# EasyEDA Pro project ProPrj_CAR BY HAO V1.3(no osd)_2026-07-17.epro, schematic Schematic1

## Sheets
1 mcu f405: Board Name: Board1; Create Date: 2026-05-24; Page Name: mcu f405; Project Name: CAR BY HAO V1.3(no osd); Schematic Name: Schematic1; Update Date: 2026-07-02; Company: EasyEDA.com; Page Size: A4; Version: V1.0
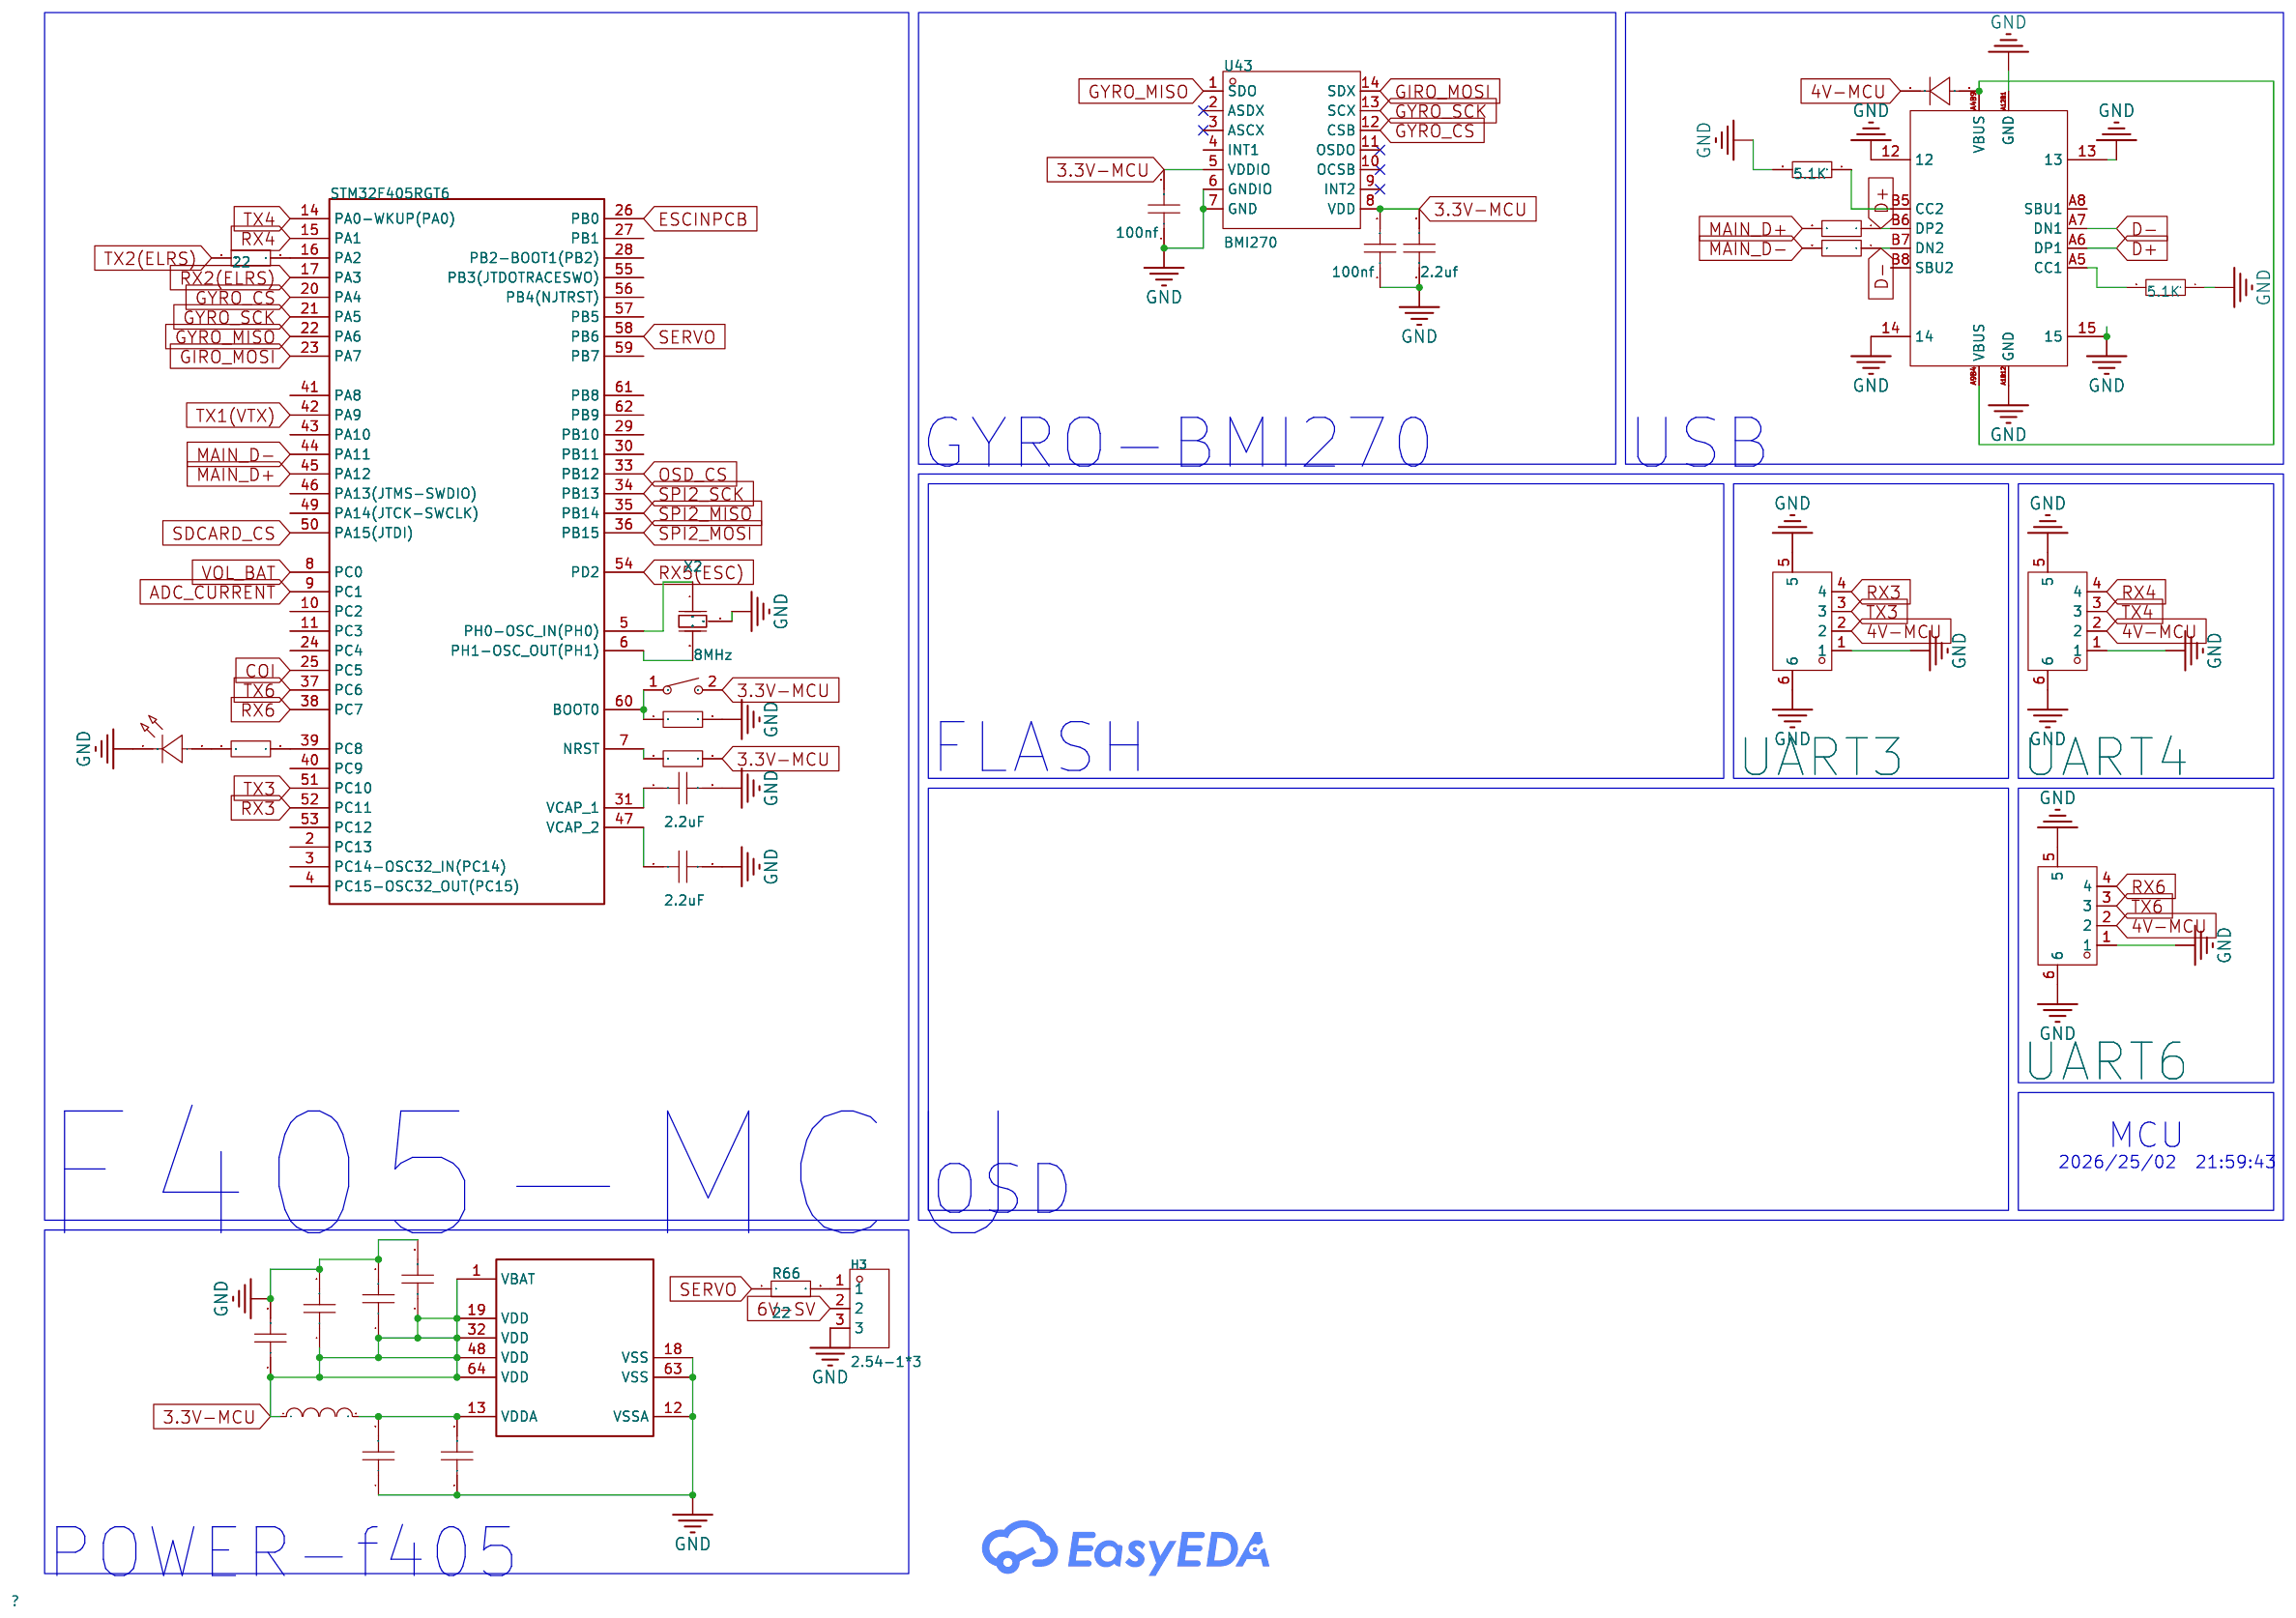
[diagram p0: mcu f405]
2 pô WE rờ: Page Name: pô WE rờ; Update Date: 2026-06-27
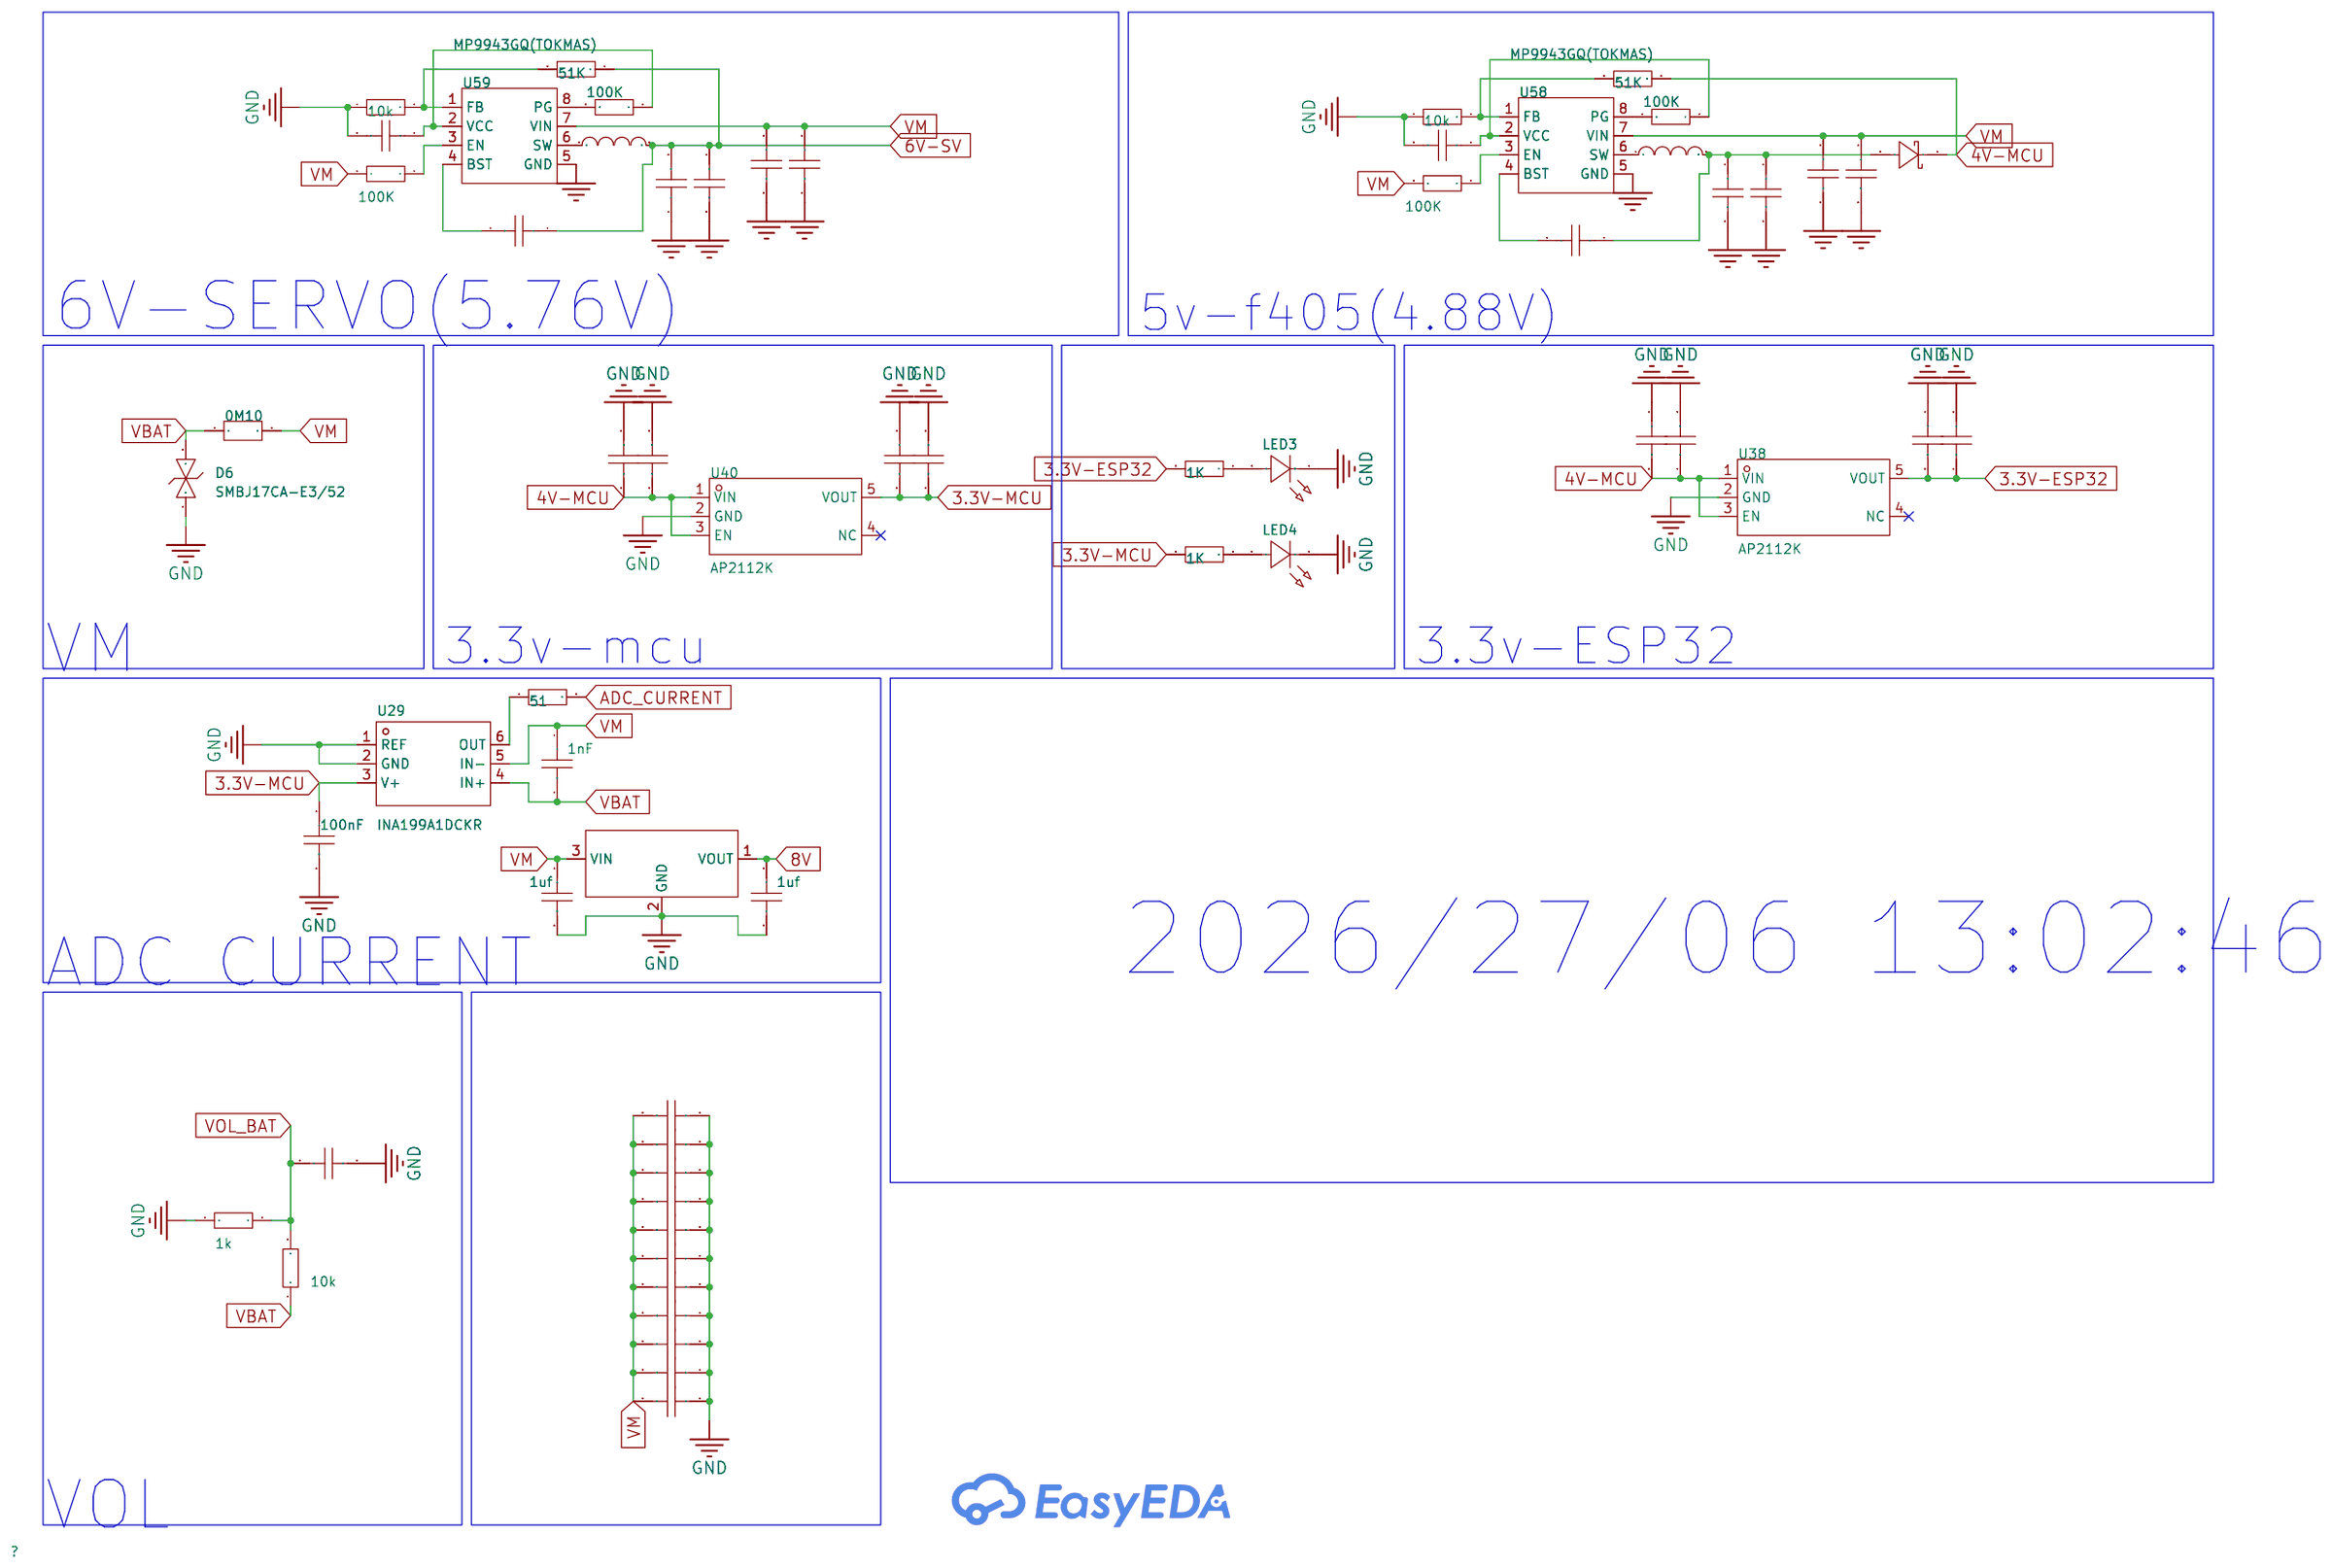
[diagram p1: pô WE rờ]
3 ÉC: Page Name: ÉC; Update Date: 2026-06-27
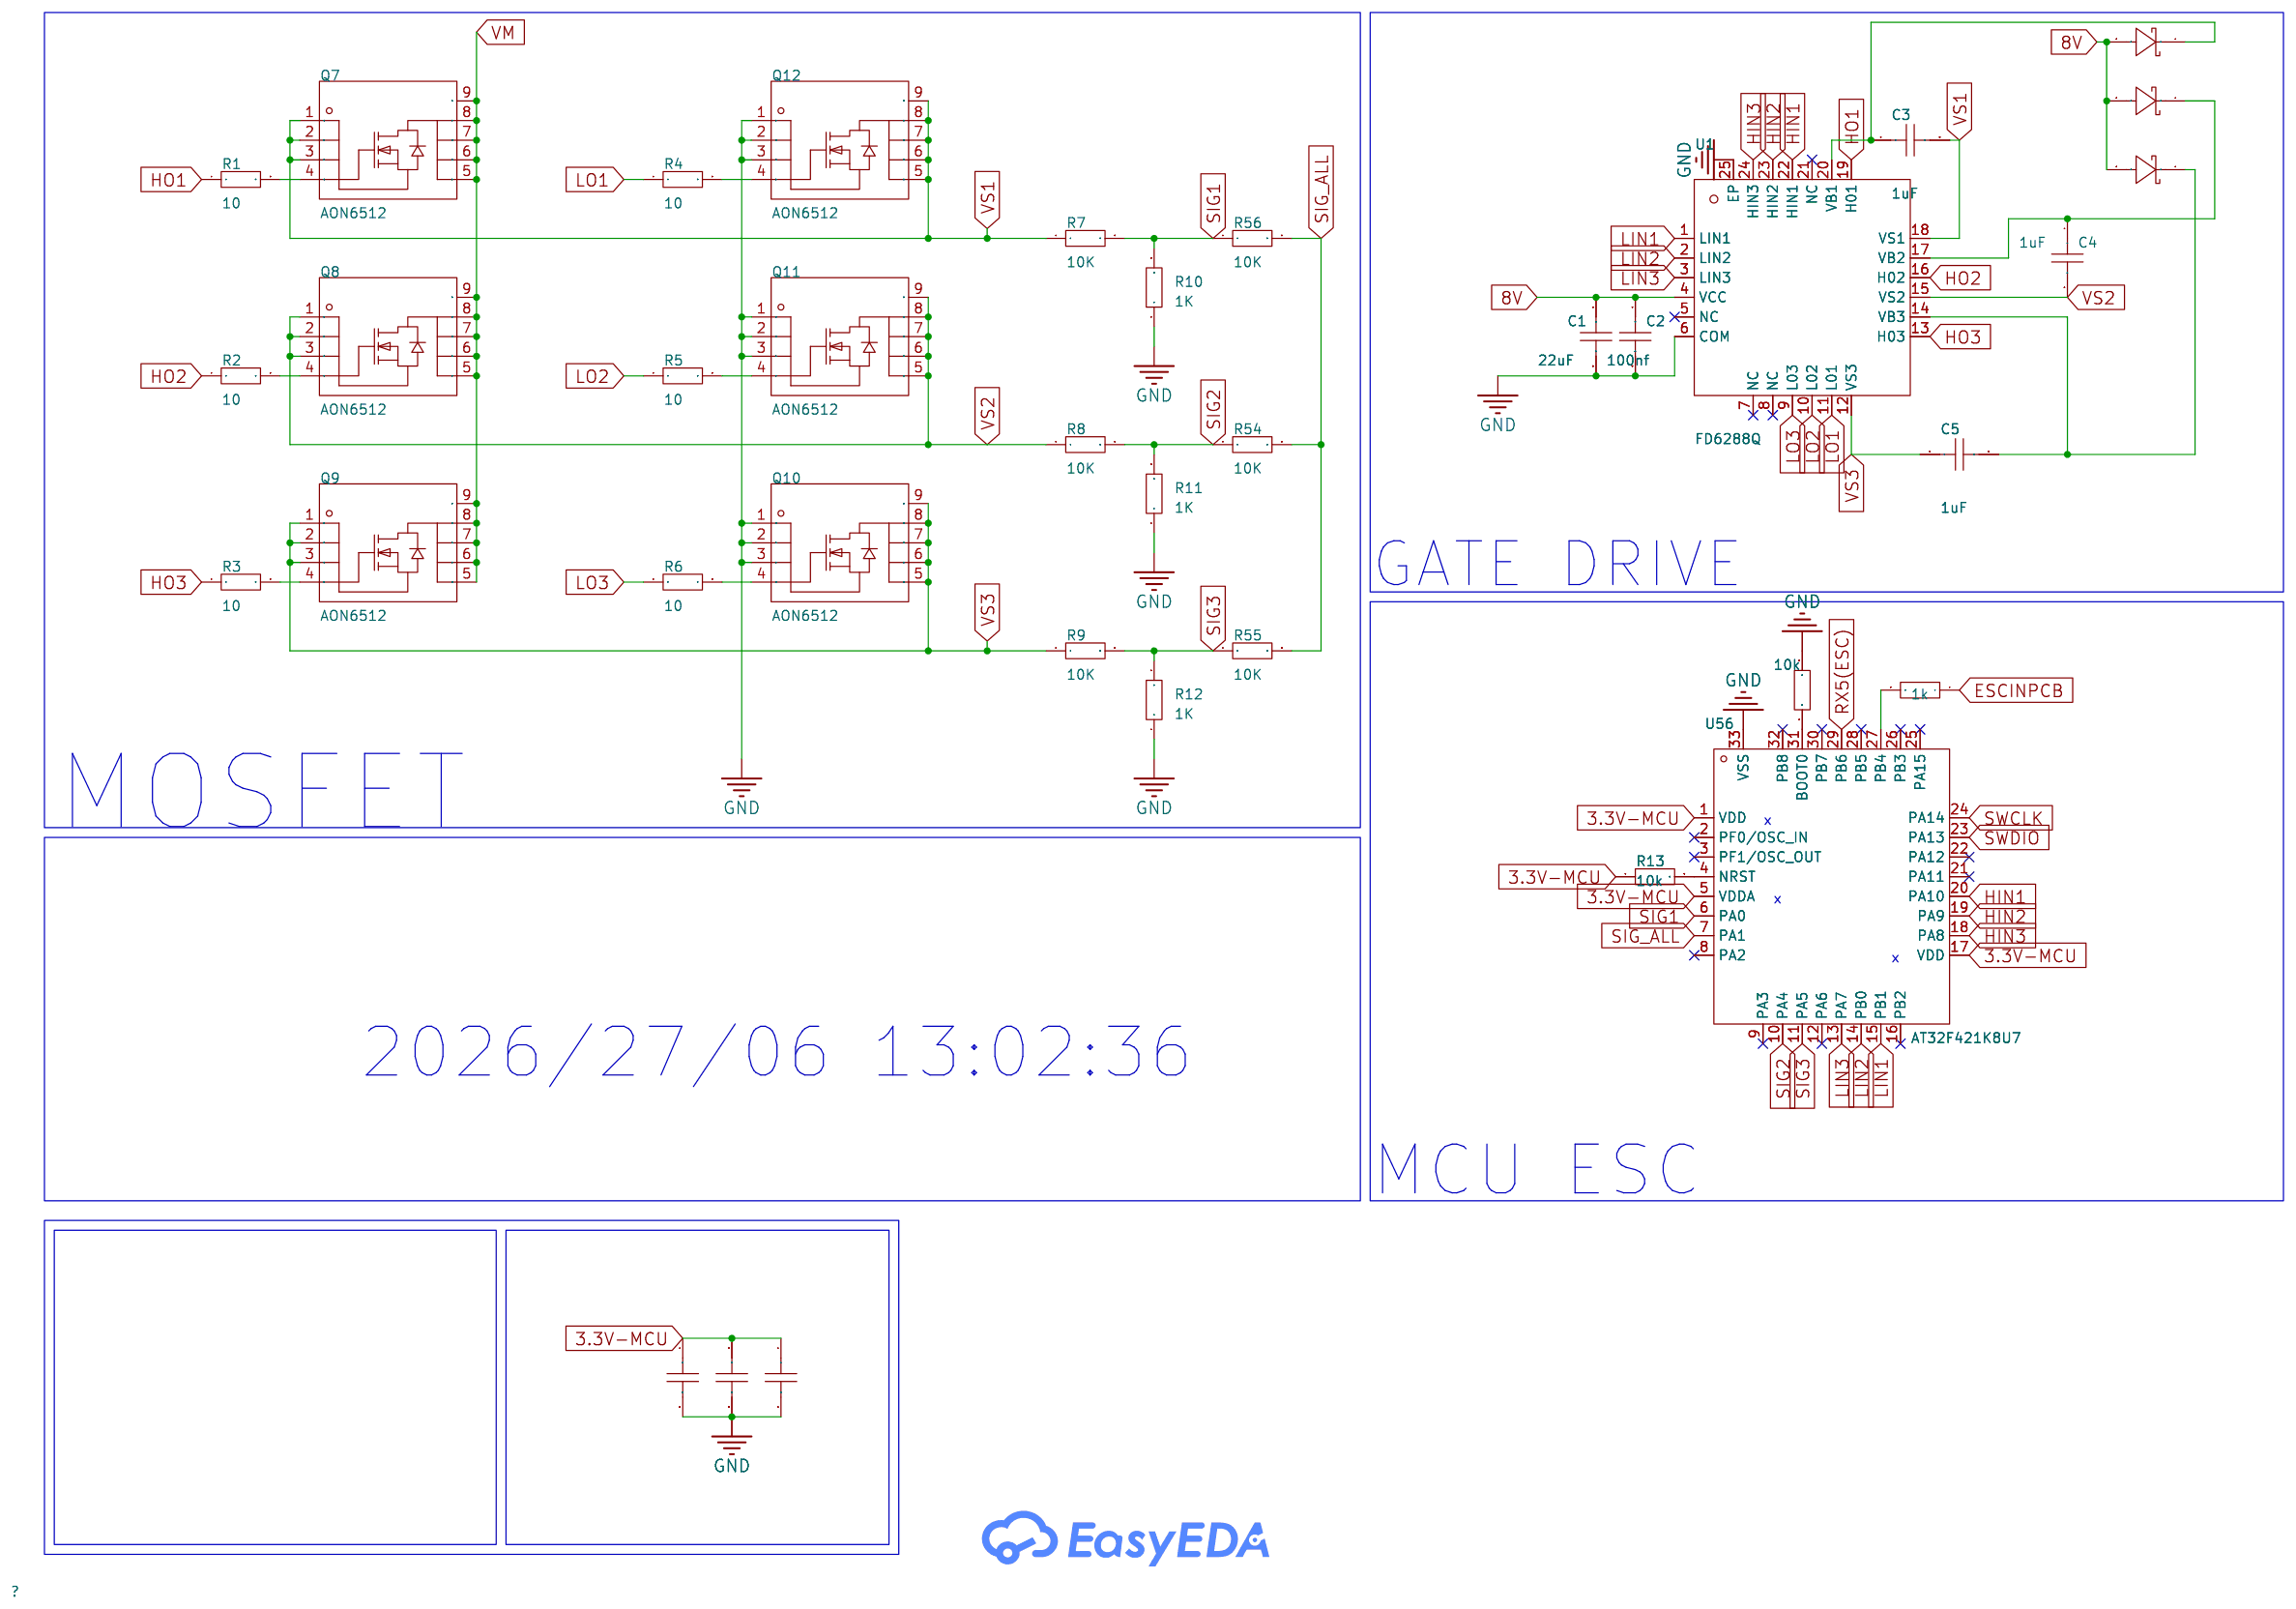
[diagram p2: ÉC]
4 Elrs: Page Name: Elrs; Update Date: 2026-06-27
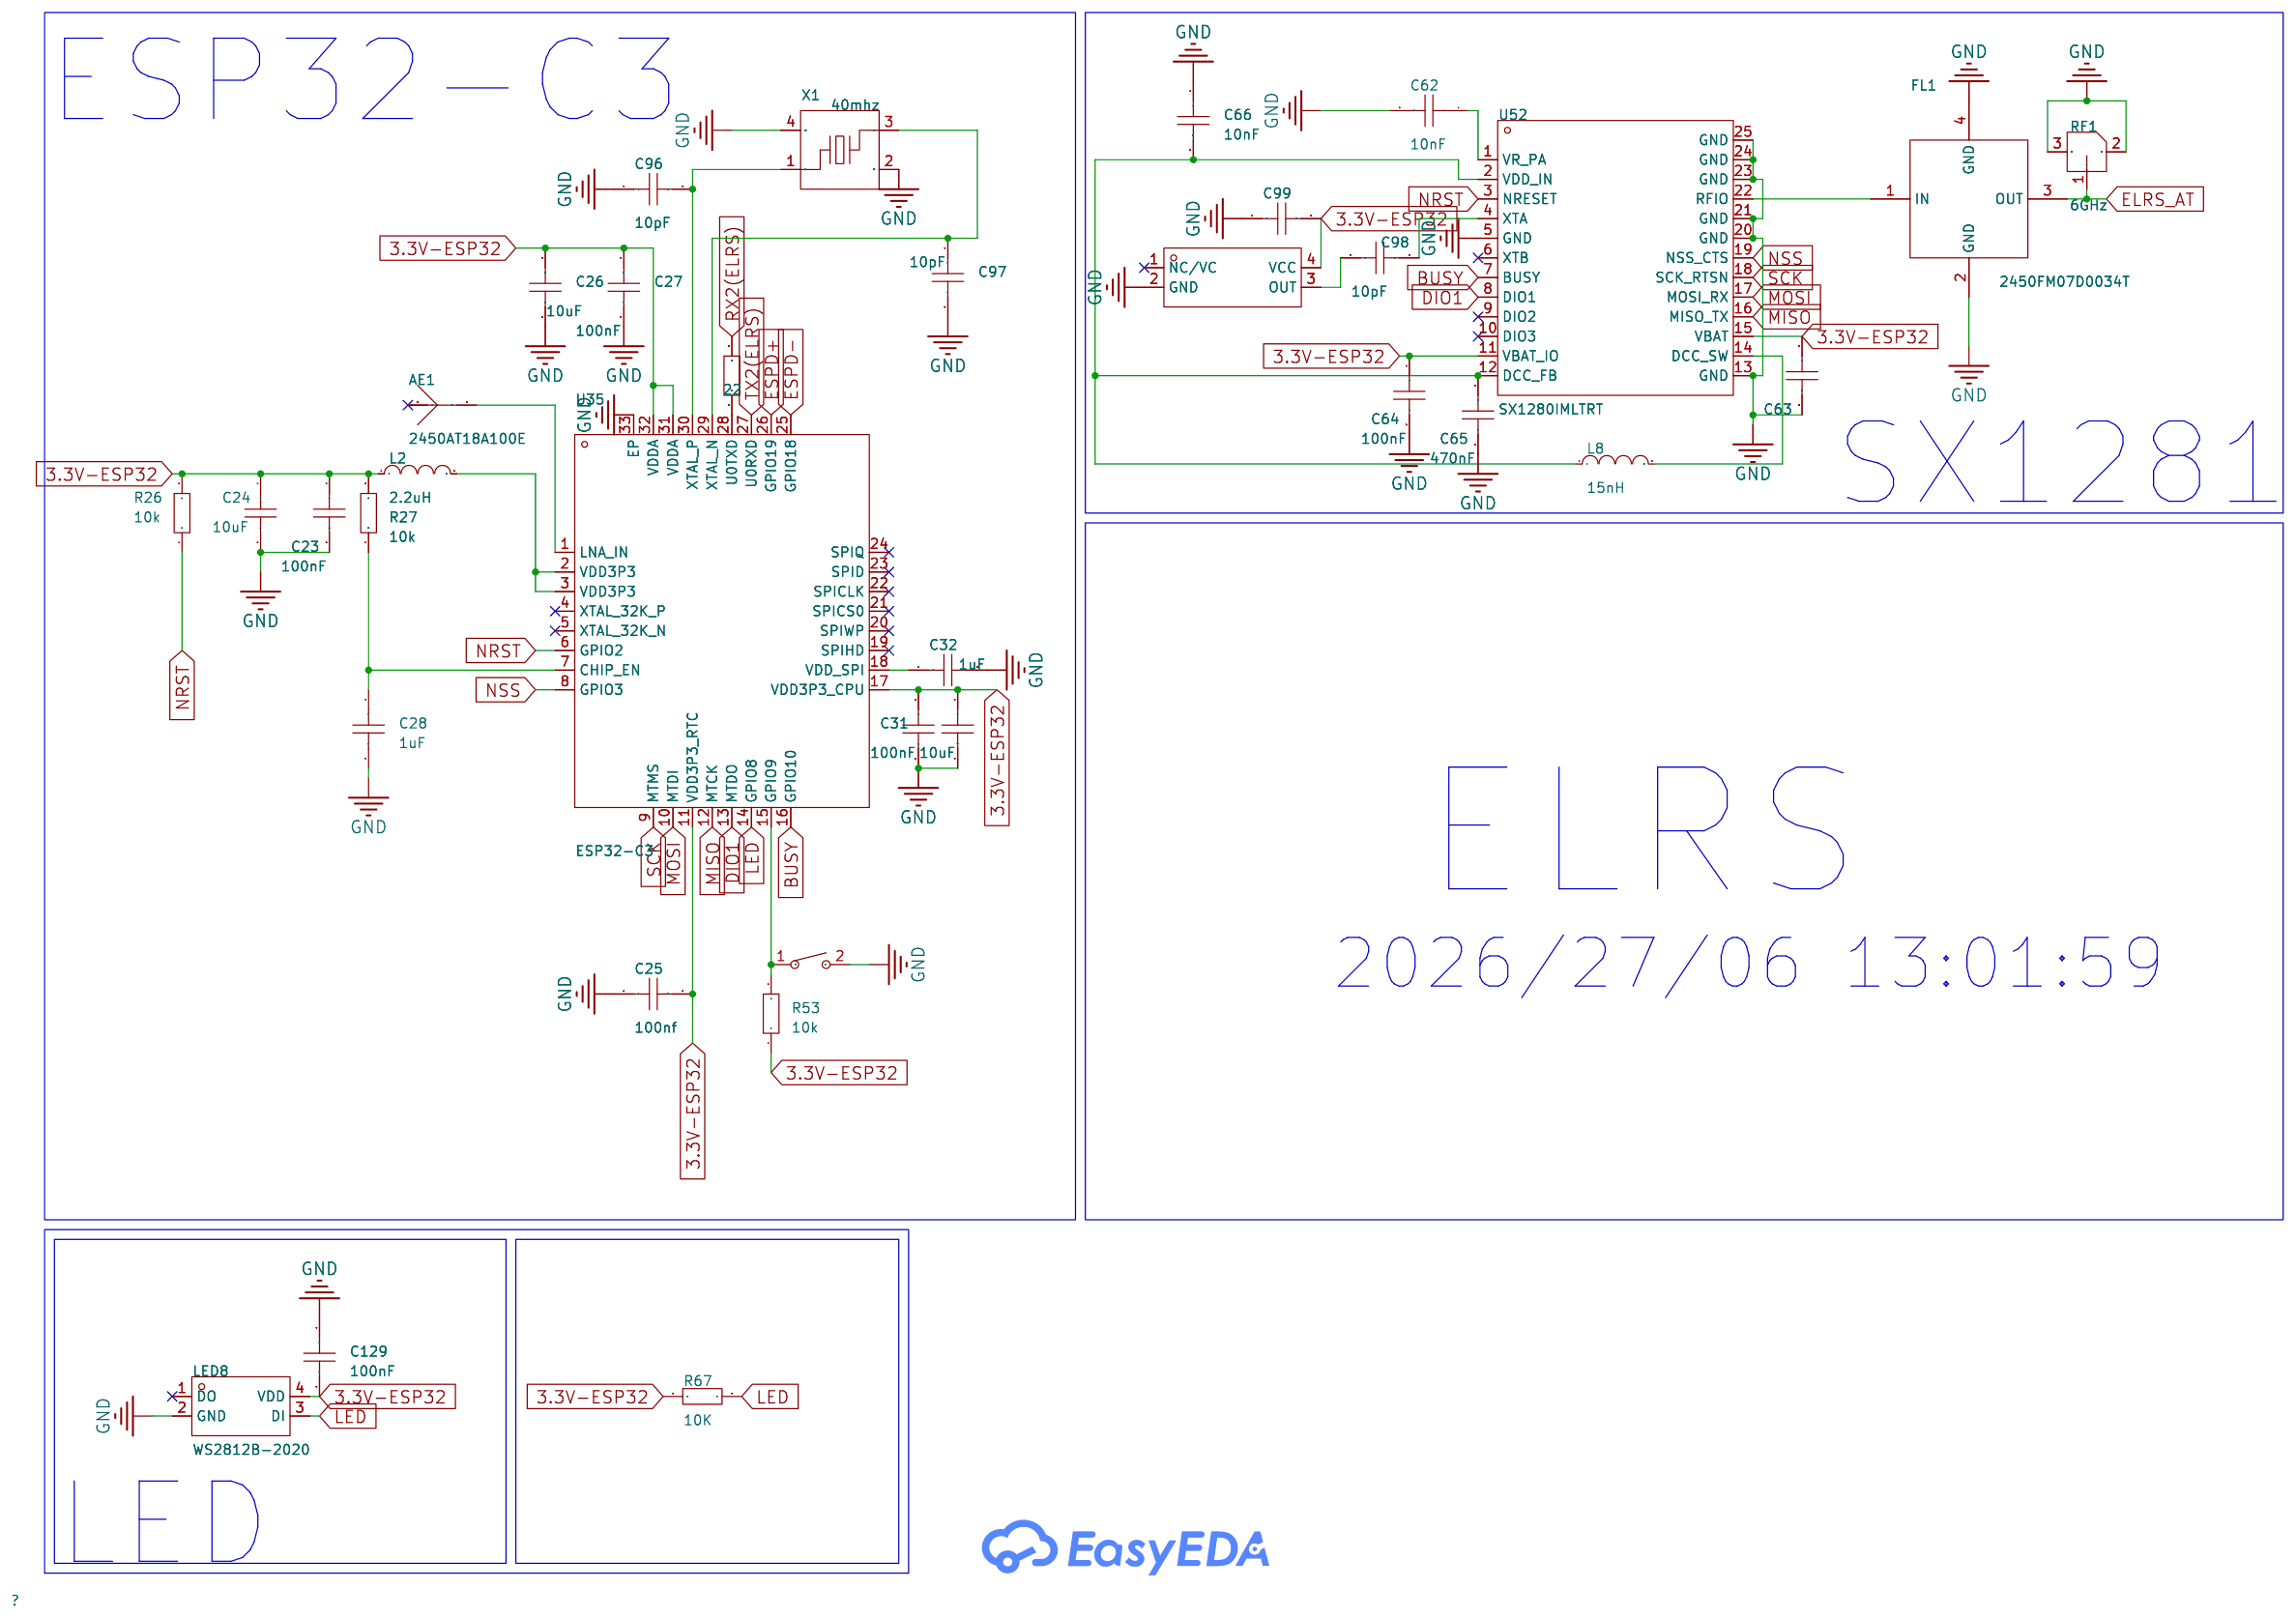
[diagram p3: Elrs]

## Parts
sheet Elrs
AE1  2450AT18A100E  [ANT-SMD_L3.2-W1.6]
C23  100nF  [C0402]
C24  10uF  [C0402]
C25  100nF  [C0402]
C26  10uF  [C0402]
C27  100nF  [C0402]
C28  1uF  [C0402]
C31  100nF  [C0402]
C32  1uF  [C0402]
C62  10nF  [C0402]
C63  100nF  [C0402]
C64  100nF  [C0402]
C65  470nF  [C0402]
C66  10nF  [C0402]
C96  10pF  [C0402]
C97  10pF  [C0402]
C98  10pF  [C0402]
C99  100nF  [C0402]
C128  10uF  [C0402]
C129  100nF  [C0402]
FL1  2450FM07D0034T  [FILTER-SMD_4P-L1.0-W0.5-L]
L2  2.2uH  [L0402]
L8  15uH  [L0603-RD]
LED8  WS2812B-2020  [LED-SMD_4P-L2.0-W2.0-TL_WS2812B-2020]
R26  10K  [R0402]
R27  10K  [R0402]
R53  10K  [R0402]
R64  22  [R0402]
R67  10K  [R0402]
RF1  6GHz  [IPEX-SMD_3P-L2.6-W2.6-LS3.0_RF1200001R]
SW3  K2-1807SN-B4DW-06  [SW-SMD_L4.0-W2.9-LS4.8-2]
U35  ESP32-C3  [QFN-32_L5.0-W5.0-P0.50-TL-EP3.7]
U52  SX1280IMLTRT  [QFN-24_L4.0-W4.0-P0.50-BL-EP2.6]
U57  52MHz  [OSC-SMD_4P-L2.0-W1.6-BL]
X1  40MHz  [CRYSTAL-SMD_4P-L2.0-W1.6-BL]
sheet mcu f405
C51  1uF  [C0402]
C52  100nF  [C0402]
C53  2.2uF  [C0402]
C54  100nF  [C0402]
C56  100nF  [C0402]
C57  100nF  [C0402]
C58  100nF  [C0402]
C59  100nF  [C0402]
C60  100nF  [C0402]
C61  100nF  [C0402]
C123  100nF  [C0402]
H3  2.54-1*3  [HDR-TH_3P-P2.54-V-M-1]
LED6  HSMD-C190  [LED0603-RD]
R40  10K  [0402]
R41  10K  [R0402]
R42  10K  [R0402]
R43  1K  [0402]
R44  10K  [0402]
R47  10K  [R0402]
R48  10K  [R0402]
R65  22  [R0402]
R66  22  [R0402]
SW1  Ferrite Bead 0603  [L0603]
SW2  K2-1807SN-B4DW-06  [SW-SMD_L4.0-W2.9-LS4.8-2]
U42  STM32F405RGT6  [LQFP-64_L10.0-W10.0-P0.50-LS12.0-BL]  (sections 1,2)
U43  BMI270  [LGA-14_L3.0-W2.5-P0.50-BR]
U53  TYPE C-ZL-102PWB  [TYPE-C-SMD_HDGC_TYPE-C-ZL-103PWB]
U55  1N5819W  [SOD-123_L2.7-W1.6-LS3.7-RD-1]
UART2  UART3  [CONN-SMD_4P-P1.00_MEGASTAR_ZX-SH1.0-4PWT]
UART3  UART4  [CONN-SMD_4P-P1.00_MEGASTAR_ZX-SH1.0-4PWT]
UART4  UART6  [CONN-SMD_4P-P1.00_MEGASTAR_ZX-SH1.0-4PWT]
X2  8MHz  [OSC-SMD_3P-L3.2-W1.3-P1.20-L]
sheet pô WE rờ
C8  22uf  [C1206]
C9  22uf  [C1206]
C10  22uf  [C1206]
C11  22uf  [C1206]
C12  22uf  [C1206]
C17  100nF  [C0402]
C18  1nF  [C0402]
C19  100nF  [C0402]
C72  22uf  [C1206]
C73  22uF  [C0603]
C74  22uF  [C0603]
C79  22uF  [C0603]
C80  22uF  [C0603]
C81  22uF  [C0603]
C82  22uf  [C1206]
C87  22uF  [C0603]
C91  100nF  [C0402]
C92  100nF  [C0402]
C101  100nF  [C0402]
C102  22uf  [C1206]
C104  22uF  [C0603]
C105  22uF  [C0603]
C107  100nF  [C0402]
C116  100nF  [C0402]
C117  100nF  [C0402]
C118  100nF  [C0402]
C119  100nF  [C0402]
C120  100nF  [C0402]
C121  100nF  [C0402]
C122  22uF  [C0603]
C124  1uf  [C0402]
C125  1uf  [C0402]
C126  22uf  [C1206]
C127  22uf  [C1206]
C130  22uf  [C1206]
C131  22uf  [C1206]
D5  DSK34  [SOD-123FL_L2.8-W1.9-LS3.7-RD]
D6  SMBJ17CA-E3/52  [SMB_L4.3-W3.6-LS5.4-BI]
L10  6.7uH  [IND-SMD_L5.4-W5.2_FXL0530]
L11  10uH  [IND-SMD_L5.4-W5.2_FXL0530]
LED3  HSMD-C190  [LED0603-RD]
LED4  HSMD-C190  [LED0603-RD]
R17  1mΩ  [R2512]
R18  10K  [R0402]
R20  1k  [R0402]
R21  10k  [R0402]
R35  10K  [R0402]
R36  51K  [R0402]
R37  1K  [R0402]
R57  100K  [R0402]
R58  100K  [R0402]
R59  10K  [R0402]
R60  51K  [R0402]
R61  100K  [R0402]
R62  100K  [R0402]
R63  1K  [R0402]
U29  INA199A1DCKR  [SC-70-6_L2.2-W1.3-P0.65-LS2.1-BR]
U38  AP2112K  [SOT-25-5_L3.0-W1.8-P0.95-LS3.0-BR]
U40  AP2112K  [SOT-25-5_L3.0-W1.8-P0.95-LS3.0-BR]
U58  MP9943GQ(TOKMAS)  [QFN-8_L3.0-W3.0-P0.65-BL]
U59  MP9943GQ(TOKMAS)  [QFN-8_L3.0-W3.0-P0.65-BL]
U67  SL78L10  [SOT-89-3_L4.5-W2.5-P1.50-LS4.2-BR]
sheet ÉC
C1  22uF  [C0603]
C2  100nF  [C0402]
C3  1uF  [C0402]
C4  1uF  [C0402]
C5  1uF  [C0402]
C7  100nF  [C0402]
C14  100nF  [C0402]
C94  100nF  [C0402]
Q7  AON6512  [PDFN-8_L5.6-W5.2-P1.27-LS6.1-BL]
Q8  AON6512  [PDFN-8_L5.6-W5.2-P1.27-LS6.1-BL]
Q9  AON6512  [PDFN-8_L5.6-W5.2-P1.27-LS6.1-BL]
Q10  AON6512  [PDFN-8_L5.6-W5.2-P1.27-LS6.1-BL]
Q11  AON6512  [PDFN-8_L5.6-W5.2-P1.27-LS6.1-BL]
Q12  AON6512  [PDFN-8_L5.6-W5.2-P1.27-LS6.1-BL]
R1  10  [R0402]
R2  10  [R0402]
R3  10  [R0402]
R4  10  [R0402]
R5  10  [R0402]
R6  10  [R0402]
R7  10K  [R0402]
R8  10K  [R0402]
R9  10K  [R0402]
R10  1K  [R0402]
R11  1K  [R0402]
R12  1K  [R0402]
R13  10K  [R0402]
R14  10K  [R0402]
R16  1K  [R0402]
R54  10K  [R0402]
R55  10K  [R0402]
R56  10K  [R0402]
U1  FD6288Q  [QFN-24_L4.0-W4.0-P0.50-BL-EP2.7]
U56  AT32F421K8U7  [QFN-32_L5.0-W5.0-P0.50-BL-EP3.4]
U64  1N5819WT  [SOD-523_L1.2-W0.8-LS1.6-RD]
U65  1N5819WT  [SOD-523_L1.2-W0.8-LS1.6-RD]
U66  1N5819WT  [SOD-523_L1.2-W0.8-LS1.6-RD]

## Library data of the parts
AE1 = 2450AT18A100E: Antenna Type:2.4G天线 Central Frequency:2.4GHz Bandwidth:- Peak Gain:0.5dBi Peak Gain:0.5dBi Polarization Type:- Impedance:50Ω Power capacity:2W VSWR:- Operating Temperature:-40℃~+125℃ Operating Temperature:-40℃~+125℃; LCSC Part Name: 2.4G天线; Supplier Part: C89334; Manufacturer: JOHANSON(约翰逊); Supplier Footprint: 1206; JLCPCB Part Class: Extended Part; Datasheet: https://atta.szlcsc.com/upload/public/pdf/source/20180301/C89334_15198946260391384223.pdf; Supplier: LCSC; Antenna Type: 2.4G天线; Central Frequency: 2.4GHz; Peak Gain: 0.5dBi; Impedance: 50Ω; Power capacity: 2W; Operating Temperature: -40℃~+125℃
C2-C5 C7 C14 C17-C19 C23-C28 C31 C32 C51-C54 C58-C66 C91 C92 C94 C96-C99 C116-C121 C123-C125 C128 C129 = CAP_0402: Supplier Part: C1525; Supplier Footprint: 0402
FL1 = 2450FM07D0034T: Filter Type:- Frequency - Center:- Cut-Off Frequency:- Absolute Bandwidth:2.4GHz~2.5GHz Absolute Bandwidth:2.4GHz~2.5GHz Relative Bandwidth:- Relative Bandwidth:- Attenuation:30dB；30dB；25dB；35dB；8dB；9.5dB Impedance:50Ω Ripple:- Insertion Loss:0.75dB Opera; LCSC Part Name: 2.45GHz阻抗匹配前端滤波器 停产; Supplier Part: C2651081; Manufacturer: JOHANSON(约翰逊); Supplier Footprint: SMD-4P,1x0.5mm; JLCPCB Part Class: Extended Part; Datasheet: https://item.szlcsc.com/datasheet/2450FM07D0034T/2742990.html; Supplier: LCSC; Absolute Bandwidth: 2.4GHz~2.5GHz; Attenuation: 30dB；30dB；25dB；35dB；8dB；9.5dB; Impedance: 50Ω; Insertion Loss: 0.75dB; Operating Temperature: -40℃~+85℃
L2 = L_0402
L8 = L_0402: Supplier Footprint: L0402
LED8 = WS2812B-2020: Wavelength:G:515.6nm；R:622.5nm；B:470.4nm Luminous Intensity:200mcd；160mcd；520mcd Fixed-Frequency Pwm Mode:2kHz Data Transmission Rate:800Kbit/s Voltage - Supply:5V Voltage - Supply:5V Quiescent Current:- Lens Color:- ESD Withstand Voltage:- Installation m; LCSC Part Name: RGB三色 停产; Supplier Part: C965555; Manufacturer: worldsemi; Supplier Footprint: SMD,2.2x2mm; JLCPCB Part Class: Extended Part; Datasheet: https://item.szlcsc.com/datasheet/WS2812B-2020/1051115.html; Supplier: LCSC; Wavelength: G:515.6nm；R:622.5nm；B:470.4nm; Luminous Intensity: 200mcd；160mcd；520mcd; Fixed-Frequency Pwm Mode: 2kHz; Data Transmission Rate: 800Kbit/s; Voltage - Supply: 5V; Installation method: Top-mount; Height: 0.84mm; Features: Built-in power-on reset circuit；Integrated intelligent reverse connection protection function；Built-in power-on reset circuit
R1-R14 R16 R18 R20 R21 R26 R27 R35-R37 R41 R42 R47 R48 R53-R67 = Res_0402: Supplier Footprint: 0402
RF1 = IPEX-1_C47986640: Connector Type:Board Side Interface:Male Pin Number of Ports:1 Interface Diameter:2mm Interface Length/Height:1.25mm Frequency:6GHz RF Series:IPEX Impedance:50Ω Rated Voltage (Max):60V Operating Temperature Range:-40℃~+85℃ Operating Temperature Range:-40℃; LCSC Part Name: 内针 IPEX; Supplier Part: C47986640; Manufacturer: HanElectricity(瀚源); Manufacturer Part: IPEX-1; Supplier Footprint: SMD; JLCPCB Part Class: Extended Part; Datasheet: https://item.szlcsc.com/datasheet/IPEX-1/50223057.html; Supplier: LCSC; Connector Type: Board Side; Interface: Male Pin; Number of Ports: 1; Interface Diameter: 2mm; Interface Length/Height: 1.25mm; RF Series: IPEX; Impedance: 50Ω; Rated Voltage (Max): 60V; Operating Temperature Range: -40℃~+85℃
SW2 SW3 = K2-1807SN-B4DW-06: 触点电流:50mA;额定电压(DC):12V;绝缘电阻:100MΩ;安装方式:立贴;作用力:250gf@±30gf;机械寿命:100000;工作温度:-25℃~+85℃;开关长度:4mm;开关宽度:2.9mm;开关高度:2.5mm;; LCSC Part Name: 3*4*2.5小龟无柱开关; Supplier Part: C840350; Manufacturer: 韩国韩荣; Supplier Footprint: SMD; JLCPCB Part Class: Extended Part; Datasheet: https://atta.szlcsc.com/upload/public/pdf/source/20210810/47B2303F2A54EA82C8741CE08BEBC5F9.pdf; Supplier: LCSC; Contact Current: 50mA; Voltage Rating (DC): 12V; Insulation Resistance: 100MΩ; Mounting Style: 立贴; Operating Force: 250gf@±30gf; Mechanical Life: 100000; Operating Temperature: -25℃~+85℃; Switch Length: 4mm; Switch Width: 2.9mm; Switch Height: 2.5mm
U35 = ESP32-C3: CPU Core:RISC-V CPU Maximum Speed:160MHz Number of I/O:22 ADC (Bit):12bit Voltage - Supply:3V~3.6V Voltage - Supply:3V~3.6V Applications:-; LCSC Part Name: 搭载RISC-V单核CPU的超低功耗片上系统（SoC），支持2.4 GHz Wi-Fi（802.11 b/g/n）和蓝牙5（低功耗）; Supplier Part: C2838500; Manufacturer: ESPRESSIF(乐鑫); Supplier Footprint: QFN-32-EP(5x5); JLCPCB Part Class: Extended Part; Datasheet: https://item.szlcsc.com/datasheet/ESP32-C3/3013220.html; Supplier: LCSC; CPU Core: RISC-V; CPU Maximum Speed: 160MHz; Number of I/O: 22; ADC (Bit): 12bit; Voltage - Supply: 3V~3.6V
U52 = SX1280IMLTRT: Frequency Range:2.4GHz~2.5GHz Frequency Range:2.4GHz~2.5GHz Interface:SPI；UART Voltage - Supply:1.8V~3.7V Voltage - Supply:1.8V~3.7V Applications:- Output Power:12.5dBm Current Of Transmitting:24mA Sensitivity:-132dBm Receive Current:8.2mA Typical Applica; Supplier Part: C125969; Manufacturer: SEMTECH; Supplier Footprint: QFN-24-EP(4x4); JLCPCB Part Class: Extended Part; Datasheet: https://item.szlcsc.com/datasheet/SX1280IMLTRT/137249.html; Supplier: LCSC; Frequency Range: 2.4GHz~2.5GHz; Interface: SPI；UART; Voltage - Supply: 1.8V~3.7V; Output Power: 12.5dBm; Current Of Transmitting: 24mA; Sensitivity: -132dBm; Receive Current: 8.2mA; Typical Application Frequency: 2.4GHz; Operating Temperature: -40℃~+85℃; Type: transceiver
U57 = TG2016SMN 52.0000M-ECGNNM3: Frequency: Frequency Stability(Full temperature range):±500ppb Frequency Stability(Full temperature range):±500ppb Output Type:Peak Shaving Sine Wave Supply Voltage:1.8V Supply Voltage:1.8V Supply Current (Max):2.1mA Operating Temperature: Operating Tempe; LCSC Part Name: 52MHz ±500ppb 1.8V; Supplier Part: C6717546; Manufacturer: EPSON(爱普生); Supplier Footprint: SMD2016-4P; JLCPCB Part Class: Extended Part; Datasheet: https://atta.szlcsc.com/upload/public/pdf/source/20230810/145D46A439B4B6F2A3C02DACC715C9E9.pdf; Supplier: LCSC; Frequency Stability(Full temperature range): ±500ppb; Output Type: Peak Shaving Sine Wave; Supply Voltage: 1.8V; Supply Current (Max): 2.1mA
X1 = S201648M8PF10PPM: Frequency:48MHz Load Capacitance:8pF Frequency Stability:±10ppm Frequency Stability:±10ppm; LCSC Part Name: 48MHz 8pF; Supplier Part: C7420785; Manufacturer: SOSET(索斯特); Supplier Footprint: SMD2016; JLCPCB Part Class: Extended Part; Datasheet: https://item.szlcsc.com/datasheet/S201648M8PF10PPM/8399560.html; Supplier: LCSC; Load Capacitance: 8pF; Frequency Stability: ±10ppm
C56 C57 C101 C107 = CAP_0402: Supplier Footprint: 0402
H3 = 2.54-1*3: Pin Structure:1x3P Pitch:2.54mm Circluar Pins/Square Pins:Pin Header Mounting Type:Through Hole Number of Rows:1 Number of Pins:3P Current Rating:2.5A Length of Mating Pin:6mm Insulation Height:2.54mm Length of End Connection Pin:3mm Contact Material:Bras; LCSC Part Name: 停产 1x3P 间距:2.54mm 方针 直插; Supplier Part: C5116482; Manufacturer: ZHOURI(洲日); Supplier Footprint: 插件,P=2.54mm; JLCPCB Part Class: Extended Part; Datasheet: https://item.szlcsc.com/datasheet/2.54-1*3/5692725.html; Supplier: LCSC; Pin Structure: 1x3P; Pitch: 2.54mm; Circluar Pins/Square Pins: Pin Header; Mounting Type: Through Hole; Number of Rows: 1; Number of Pins: 3P; Current Rating: 2.5A; Length of Mating Pin: 6mm; Insulation Height: 2.54mm; Length of End Connection Pin: 3mm; Contact Material: Brass; Contact Plating: Gold; Operating Temperature: -40℃~+105℃
LED3 LED4 LED6 = HSMD-C190: Illumination Color:Orange Voltage - Forward(Vf):2.2V Voltage - Forward(Vf):2.2V Power(Watts):52mW Forward Current:20mA Wavelength - Dominant:604nm Wavelength - Dominant:604nm Peak Wavelength:605nm Luminous Intensity:8mcd Luminous Intensity:8mcd Viewing An; Supplier Part: C18198804; Manufacturer: Broadcom(博通); Supplier Footprint: 0603; JLCPCB Part Class: Extended Part; Datasheet: https://item.szlcsc.com/datasheet/HSMD-C190/19352652.html; Supplier: LCSC; Illumination Color: Orange; Voltage - Forward(Vf): 2.2V; Power(Watts): 52mW; Forward Current: 20mA; Wavelength - Dominant: 604nm; Peak Wavelength: 605nm; Luminous Intensity: 8mcd; Viewing Angle: 170°; Operating Temperature: -40℃~+85℃
R40 R43 R44 = R0402: Check: false
SW1 = HCB1606ZF-260T60: Impedance @ Frequency:26Ω@100MHz Tolerance:±25% Tolerance:±25% DC Resistance(DCR):10mΩ Current Rating:6A Number of Circuits:1; LCSC Part Name: 单路 0602磁珠 阻抗26Ω@100MHz; Supplier Part: C2880056; Manufacturer: TAI-TECH(台庆); Supplier Footprint: 0602; JLCPCB Part Class: Extended Part; Datasheet: https://item.szlcsc.com/datasheet/HCB1606ZF-260T60/3089680.html; Supplier: LCSC; Impedance @ Frequency: 26Ω@100MHz; Tolerance: ±25%; DC Resistance(DCR): 10mΩ; Current Rating: 6A; Number of Circuits: 1
U42 = STM32F405RGT6: LCSC Part Name: 带DSP和FPU的高性能基础系列ARM Cortex-M4 MCU，具有1 MB Flash、168 MHz CPU和ART加速器; Supplier Part: C15742; Manufacturer: ST(意法半导体); Supplier Footprint: LQFP-64(10x10); JLCPCB Part Class: Extended Part; Datasheet: https://item.szlcsc.com/datasheet/STM32F405RGT6/16424.html; Supplier: LCSC; CPU Core: ARM-M4; CPU Maximum Speed: 168MHz; Program Storage Size: 1MB; Program Memory Type: FLASH; Number of I/O: 51; ADC (Bit): 12bit; DAC (Bit): 12bit; Voltage - Supply: 1.8V~3.6V
U43 = BMI270: Sensor Type:加速度计陀螺仪 Operating Temperature:-40℃~+85℃ Operating Temperature:-40℃~+85℃; Supplier Part: C2836813; Manufacturer: Bosch(博世); Supplier Footprint: LGA-14(2.5x3); JLCPCB Part Class: Extended Part; Datasheet: https://atta.szlcsc.com/upload/public/pdf/source/20210625/C2836813_35E1F3F92097F45A3828DF13DDBA01A5.pdf; Supplier: LCSC; Sensor Type: 加速度计陀螺仪; Operating Temperature: -40℃~+85℃
U53 = TYPE C-ZL-102PWB: Connector Type:Type-C Gender:Female Mounting Type:Surface Mount, Right Angle Number of Contacts:16P Number of Ports:1 Connect-Disconnect Life:10,000 cycles Length:7.35mm Detection color:maize-yellow; LCSC Part Name: Type-C 母 卧贴; Supplier Part: C5273950; Manufacturer: HDGC(华德共创); Supplier Footprint: SMD; JLCPCB Part Class: Extended Part; Datasheet: https://item.szlcsc.com/datasheet/TYPE%2520C-ZL-102PWB/6003801.html; Supplier: LCSC; Connector Type: Type-C; Gender: Female; Mounting Type: Surface Mount, Right Angle; Number of Contacts: 16P; Number of Ports: 1; Connect-Disconnect Life: 10,000 cycles; Length: 7.35mm; Detection color: maize-yellow
U55 = 1N4148W_C7603179: Diode Configuration:Independent Voltage - Forward(Vf@If):1.25V@150mA Voltage - DC Reverse(Vr):100V Current - Rectified:150mA Pd - Power Dissipation:400mW Reverse Leakage Current (Ir):1uA@75V Reverse Recovery Time (trr):4ns Operating Junction Temperature R; LCSC Part Name: 100V 150mA; Supplier Part: C7603179; Manufacturer: KUU; Manufacturer Part: 1N4148W; Supplier Footprint: SOD-123; JLCPCB Part Class: Extended Part; Datasheet: https://item.szlcsc.com/datasheet/1N4148W/8728673.html; Supplier: LCSC; Diode Configuration: Independent; Voltage - Forward(Vf@If): 1.25V@150mA; Voltage - DC Reverse(Vr): 100V; Current - Rectified: 150mA; Pd - Power Dissipation: 400mW; Reverse Leakage Current (Ir): 1uA@75V; Reverse Recovery Time (trr): 4ns; Operating Junction Temperature Range: -55℃~+150℃@(Tj)
UART2-UART4 = ZX-SH1.0-4PWT: 参考系列:SH;间距:1mm;插针结构:1x4P;排数:1;每排PIN数:4;行距:-;公母:公型插针;安装方式:卧贴;额定电流:1A;触头材质:黄铜;触头镀层:锡;工作温度范围:-25℃~+85℃;焊接温度(最大值):260℃;; LCSC Part Name: SH 1mm 1x4P 卧贴; Supplier Part: C7430446; Manufacturer: Megastar(兆星); Supplier Footprint: SMD,P=1mm; JLCPCB Part Class: 扩展库; Datasheet: https://atta.szlcsc.com/upload/public/pdf/source/20230619/390816C24B7A0EB1D042395C380CEA99.pdf; Supplier: LCSC; Reference Series: SH; Pitch: 1mm; Pins Structure: 1x4P; Number of Rows: 1; Number of PINs Per Row: 4; Gender: 公型插针; Mounting Style: 卧贴; Current Rating (Max): 1A; Contact Material: 黄铜; Contact Plating: 锡; Operating Temperature Range: -25℃~+85℃; Welding Temperature (Max): 260℃
X2 = CSTNE8M00GH5C000R0: LCSC Part Name: 8MHz ±0.07% 33pF; Supplier Part: C341525; Manufacturer: muRata(村田); Supplier Footprint: SMD; JLCPCB Part Class: Extended Part; Datasheet: https://atta.szlcsc.com/upload/public/pdf/source/20181211/C341525_832BA077079E4863A5153C1DB98581D5.pdf; Supplier: LCSC; Check: false
C8-C12 C72 C82 C102 C126 C127 C130 C131 = C1206C103KARECTU: Supplier Part: C34177378; Manufacturer: KEMET(基美); Supplier Footprint: 1206; Datasheet: https://item.szlcsc.com/datasheet/C1206C103KARECTU/35908289.html; Supplier: LCSC
C1 C73 C74 C79-C81 C87 C104 C105 C122 = CAP_0603: Supplier Footprint: 0603
D5 = DSK34_1: Diode Configuration:Independent Voltage - Forward(Vf@If):550mV@3A Voltage - DC Reverse(Vr):40V Current - Rectified:3A Reverse Leakage Current (Ir):100uA Operating Junction Temperature Range:-65℃~+150℃ Operating Junction Temperature Range:-65℃~+150℃ Non-Re; LCSC Part Name: 电压:40V 电流:3A; Supplier Part: C41371066; Manufacturer: GOODWORK(固得沃克); Supplier Footprint: SOD-123FL; Datasheet: https://item.szlcsc.com/datasheet/DSK34/43131904.html; Supplier: LCSC; Diode Configuration: Independent; Voltage - Forward(Vf@If): 550mV@3A; Voltage - DC Reverse(Vr): 40V; Current - Rectified: 3A; Reverse Leakage Current (Ir): 100uA; Operating Junction Temperature Range: -65℃~+150℃; Non-Repetitive Peak Forward Surge Current: 80A
D6 = SMBJ17CA-E3/52: Polarity:Bidirectional Reverse Stand-Off Voltage (Vrwm):17V Clamping Voltage:27.6V Peak Pulse Current (Ipp):21.7A@10/1000us Peak Pulse Power Dissipation (Ppp):600W@10/1000us Voltage - Breakdown:20.9V Reverse Leakage Current (Ir):1uA Type:TVS; LCSC Part Name: 双向TVS 17V截止 峰值浪涌电流：21.7A@10/1000us; Supplier Part: C1973749; Manufacturer: VISHAY(威世); Supplier Footprint: SMB(DO-214AA); JLCPCB Part Class: Extended Part; Datasheet: https://item.szlcsc.com/datasheet/SMBJ17CA-E3%252F52/2065287.html; Supplier: LCSC; Polarity: Bidirectional; Reverse Stand-Off Voltage (Vrwm): 17V; Clamping Voltage: 27.6V; Peak Pulse Current (Ipp): 21.7A@10/1000us; Peak Pulse Power Dissipation (Ppp): 600W@10/1000us; Voltage - Breakdown: 20.9V; Reverse Leakage Current (Ir): 1uA; Type: TVS
L10 L11 = FXL0530-100-M: Inductance:10uH Tolerance:±20% Tolerance:±20% Current Rating:3.2A Current - Saturation(Isat):3.5A DC Resistance(DCR):125mΩ Type:Molded Inductor; LCSC Part Name: 10uH ±20% 3.5A; Supplier Part: C177248; Manufacturer: cjiang(长江微电); Supplier Footprint: SMD,5.4x5.2mm; JLCPCB Part Class: Extended Part; Datasheet: https://item.szlcsc.com/datasheet/FXL0530-100-M/188640.html; Supplier: LCSC; Tolerance: ±20%; Current Rating: 3.2A; Current - Saturation(Isat): 3.5A; DC Resistance(DCR): 125mΩ; Type: Molded Inductor
R17 = RE2512F3R100: Type:Current Sense Resistor；Alloy Resistor Resistance:100mΩ Tolerance:±1% Tolerance:±1% Power(Watts):3W Temperature Coefficient:±50ppm/℃ Temperature Coefficient:±50ppm/℃; LCSC Part Name: 100mΩ 3W 2512 ±1%; Supplier Part: C46961760; Manufacturer: JIERR(捷而瑞); Supplier Footprint: 2512; JLCPCB Part Class: Extended Part; Datasheet: https://item.szlcsc.com/datasheet/RE2512F3R100/49133299.html; Supplier: LCSC; Type: Current Sense Resistor；Alloy Resistor; Tolerance: ±1%; Power(Watts): 3W; Temperature Coefficient: ±50ppm/℃
U29 = INA199A1DCKR: Number of Channels:1 Vcm - Common Mode Voltage:-300mV~26V Vcm - Common Mode Voltage:-300mV~26V Gain:50V/V Bandwidth:14kHz Ib - Input Bias Current:28uA Vos - Input Offset Voltage:5uV Operating Temperature:-40℃~+105℃ Operating Temperature:-40℃~+105℃ Differe; LCSC Part Name: 电压输出、高侧或者低侧测量、双向零漂移电流分流监控器; Supplier Part: C59135; Manufacturer: TI(德州仪器); Supplier Footprint: SOT-363(SC-70-6); JLCPCB Part Class: Extended Part; Datasheet: https://www.ti.com/cn/lit/gpn/ina199; Supplier: LCSC; Number of Channels: 1; Vcm - Common Mode Voltage: -300mV~26V; Gain: 50V/V; Bandwidth: 14kHz; Ib - Input Bias Current: 28uA; Vos - Input Offset Voltage: 5uV; Operating Temperature: -40℃~+105℃; Differential Voltage: -26V~+26V; Maximum Power Supply Range (Vdd-Vss): 26V; Single Supply: 2.7V~26V; Quiescent Current: 65uA; Input Offset Voltage Drift(Vos TC): 0.5uV/℃; Input Offset Current(Ios): 20nA; Slew Rate: 0.4V/us; Common Mode Rejection Ratio (CMRR): 120dB; Noise density(eN): 25nV/√Hz@1kHz
U38 U40 = AP2112K-3.3TRG1: Output Type: Output Polarity:Positive Number of Outputs:1 Maximum Input Voltage:6V Output Voltage:3.3V~3.3V Output Voltage:3.3V~3.3V Dropout Voltage:400mV@(600mA) Output Current:600mA Power Supply Rejection Ratio (PRSS):65dB@(100Hz,1kHz); LCSC Part Name: Vin=6V Vout=3.3V 600mA 65dB@(100Hz,1kHz); Supplier Part: C51118; Manufacturer: DIODES(美台); Supplier Footprint: SOT-25; JLCPCB Part Class: Extended Part; Datasheet: https://atta.szlcsc.com/upload/public/pdf/source/20171221/C51118_15138312998391195590.pdf; Supplier: LCSC; Output Polarity: Positive; Number of Outputs: 1; Maximum Input Voltage: 6V; Output Voltage: 3.3V~3.3V; Dropout Voltage: 400mV@(600mA); Output Current: 600mA; Power Supply Rejection Ratio (PRSS): 65dB@(100Hz,1kHz)
U58 U59 = MP9943GQ(TOKMAS): Function:Buck Voltage - Supply:3V~36V Voltage - Supply:3V~36V Output Current:3A Frequency - Switching:350kHz~470kHz Frequency - Switching:350kHz~470kHz Operating Temperature:-40℃~+125℃@(TJ) Operating Temperature:-40℃~+125℃@(TJ) Synchronous Rectifier:Yes T; LCSC Part Name: 降压型 3A 3V~36V; Supplier Part: C51889390; Manufacturer: Tokmas(托克马斯); Supplier Footprint: QFN-8(3x3); JLCPCB Part Class: Extended Part; Datasheet: https://item.szlcsc.com/datasheet/MP9943GQ(TOKMAS)/54562435.html; Supplier: LCSC; Function: Buck; Voltage - Supply: 3V~36V; Output Current: 3A; Frequency - Switching: 350kHz~470kHz; Operating Temperature: -40℃~+125℃@(TJ); Synchronous Rectifier: Yes; Topology: Buck; Quiescent Current: 30uA; Switch tube (built-in/external): Built-In; Output Type: Adjustable
U67 = SL78L10: Output Configuration:Positive Voltage - Supply:35V Output Voltage:10V Output Voltage:10V Output Current:100mA Power Supply Rejection Ratio (PSRR):52dB@(120Hz) Voltage Dropout:1.7V standby current:- Noise:70uV Features:Short Circuit Protection；Thermal shut; LCSC Part Name: 10V 100mA 35V; Supplier Part: C5155455; Manufacturer: Slkor(萨科微); Supplier Footprint: SOT-89; JLCPCB Part Class: Extended Part; Datasheet: https://item.szlcsc.com/datasheet/SL78L10/5785130.html; Supplier: LCSC; Output Configuration: Positive; Voltage - Supply: 35V; Output Voltage: 10V; Output Current: 100mA; Power Supply Rejection Ratio (PSRR): 52dB@(120Hz); Voltage Dropout: 1.7V; Noise: 70uV; Features: Short Circuit Protection；Thermal shutdown；Over Current Protection; Operating Temperature: 0℃~+125℃@(Tj); Output Type: Fixed; Number of Outputs: 1
Q7-Q12 = AON6512_C485679: Number:1 N-Channel Drain to Source Voltage:30V Current - Continuous Drain(Id):- RDS(on):1.7mΩ@10V,20A Pd - Power Dissipation:- Gate Threshold Voltage (Vgs(th)):2V; LCSC Part Name: 1个N沟道 耐压:30V 电流:54A; Supplier Part: C485679; Manufacturer: AOS; Supplier Footprint: PDFN-8(5.2x5.6); JLCPCB Part Class: Extended Part; Datasheet: https://item.szlcsc.com/datasheet/AON6512/494118.html; Supplier: LCSC; Number: 1 N-Channel; Drain to Source Voltage: 30V; RDS(on): 1.7mΩ@10V,20A; Gate Threshold Voltage (Vgs(th)): 2V
U1 = FD6288Q: Supplier Part: C97677; Supplier Footprint: QFN-24-EP(4x4); JLCPCB Part Class: Extended Part; Supplier: LCSC
U56 = AT32F421K8U7: LCSC Part Name: 基于 ARM 的 32 位 Cortex-M4 微控制器，具备闪存、定时器、ADC、比较器和通信接口; Supplier Part: C2965611; Manufacturer: ARTERY(雅特力); Supplier Footprint: QFN-32(5x5); JLCPCB Part Class: Extended Part; Datasheet: https://item.szlcsc.com/datasheet/AT32F421K8U7/3357884.html; Supplier: LCSC
U64-U66 = 1N5819WT_C5185918: Diode Configuration:Independent Voltage - Forward(Vf@If):600mV@200mA Voltage - DC Reverse(Vr):40V Current - Rectified:350mA Reverse Leakage Current (Ir):5uA@30V Non-Repetitive Peak Forward Surge Current:2A; LCSC Part Name: 电压:40V 电流:350mA; Supplier Part: C5185918; Manufacturer: Slkor(萨科微); Supplier Footprint: SOD-523; JLCPCB Part Class: Extended Part; Datasheet: https://item.szlcsc.com/datasheet/1N5819WT/5856478.html; Supplier: LCSC; Diode Configuration: Independent; Voltage - Forward(Vf@If): 600mV@200mA; Voltage - DC Reverse(Vr): 40V; Current - Rectified: 350mA; Reverse Leakage Current (Ir): 5uA@30V; Non-Repetitive Peak Forward Surge Current: 2A

## Nets
3.3V-ESP32: C23.1 C24.1 C25.2 C26.1 C27.1 C31.1 C63.1 C64.1 C74.2 C99.2 C118.1 C128.1 C129.2 L2.1 LED8.4(VDD) R26.2 R27.2 R37.2 R53.1 R67.2 U35.11(VDD3P3_RTC) U35.17(VDD3P3_CPU) U35.31(VDDA) U35.32(VDDA) U38.5(VOUT) U52.11(VBAT_IO) U52.15(VBAT) U57.4(VCC)
3.3V-MCU: C7.1 C14.1 C17.1 C53.2 C54.2 C58.1 C59.1 C60.1 C61.1 C79.2 C94.1 C117.1 C123.2 R13.1 R40.2 R63.2 SW1.1 SW2.2 U29.3(V+) U40.5(VOUT) U42.1(VBAT) U42.19(VDD) U42.32(VDD) U42.48(VDD) U42.64(VDD) U43.5(VDDIO) U43.8(VDD) U56.1(VDD) U56.5(VDDA) U56.17(VDD)
4V-MCU: C73.2 C80.2 C91.1 C92.1 D5.1(K) R36.1 U38.1(VIN) U38.3(EN) U40.1(VIN) U40.3(EN) U55.1(C) UART2.2 UART3.2 UART4.2
6V-SV: C102.2 C105.1 C107.1 H3.2 L11.2 R60.1
8V: C1.1 C2.1 C124.1 U1.4(VCC) U64.2 U65.2 U66.2 U67.1(VOUT)
GND: C1.2 C2.2 C7.2 C8.1 C9.1 C10.1 C11.1 C12.1 C14.2 C17.2 C19.2 C23.2 C24.2 C25.1 C26.2 C27.2 C28.2 C31.2 C32.2 C51.1 C52.1 C53.1 C54.1 C56.2 C57.2 C58.2 C59.2 C60.2 C61.2 C62.2 C63.2 C64.2 C65.2 C66.1 C72.1 C73.1 C74.1 C79.1 C80.1 C81.2 C82.1 C87.2 C91.2 C92.2 C94.2 C96.1 C97.2 C99.1 C102.1 C104.2 C105.2 C116.2 C117.2 C118.2 C119.1 C120.2 C121.1 C122.2 C123.1 C124.2 C125.2 C126.1 C127.1 C128.2 C129.1 C130.1 C131.1 D6.1 FL1.2(GND) FL1.4(GND) H3.3 LED3.1(C) LED4.1(C) LED6.1(C) LED8.2(GND) Q10.1(S) Q10.2(S) Q10.3(S) Q11.1(S) Q11.2(S) Q11.3(S) Q12.1(S) Q12.2(S) Q12.3(S) R10.1 R11.1 R12.1 R14.2 R20.1 R35.1 R41.1 R42.2 R44.2 R59.1 RF1.2 RF1.3 SW3.2 U1.6(COM) U1.25(EP) U29.1(REF) U29.2(GND) U35.33(EP) U38.2(GND) U40.2(GND) U42.12(VSSA) U42.18(VSS) U42.63(VSS) U43.6(GNDIO) U43.7(GND) U52.5(GND) U52.13(GND) U52.20(GND) U52.21(GND) U52.23(GND) U52.24(GND) U52.25(GND) U53.12 U53.13 U53.14 U53.15 U53.A1B12(GND) U53.A12B1(GND) U56.33(VSS) U57.2(GND) U58.5(GND) U59.5(GND) U67.2(GND) UART2.1 UART2.5 UART2.6 UART3.1 UART3.5 UART3.6 UART4.1 UART4.5 UART4.6 X1.2(GND) X1.4(GND) X2.2(GND)
VBAT: C18.2 D6.2 R17.1 R21.1 U29.4(IN+)
ADC_CURRENT: R18.2 U42.9(PC1)
BUSY: U35.16(GPIO10) U52.7(BUSY)
COI: U42.25(PC5)
D+: R48.1 U53.A6(DP1) U53.B6(DP2)
D-: R47.1 U53.A7(DN1) U53.B7(DN2)
DIO1: U35.13(MTDO) U52.8(DIO1)
ELRS_AT: FL1.3(OUT) RF1.1
ESCINPCB: R16.1 U42.26(PB0)
ESPD+: U35.26(GPIO19)
ESPD-: U35.25(GPIO18)
GIRO_MOSI: U42.23(PA7) U43.14(SDX)
GYRO_CS: U42.20(PA4) U43.12(CSB)
GYRO_MISO: U42.22(PA6) U43.1(SDO)
GYRO_SCK: U42.21(PA5) U43.13(SCX)
HIN1: U1.22(HIN1) U56.20(PA10)
HIN2: U1.23(HIN2) U56.19(PA9)
HIN3: U1.24(HIN3) U56.18(PA8)
HO1: R1.1 U1.19(H01)
HO2: R2.1 U1.16(H02)
HO3: R3.1 U1.13(H03)
LED: LED8.3(DI) R67.1 U35.14(GPIO8)
LIN1: U1.1(LIN1) U56.15(PB1)
LIN2: U1.2(LIN2) U56.14(PB0)
LIN3: U1.3(LIN3) U56.13(PA7)
LO1: R4.1 U1.11(L01)
LO2: R5.1 U1.10(L02)
LO3: R6.1 U1.9(L03)
MAIN_D+: R48.2 U42.45(PA12)
MAIN_D-: R47.2 U42.44(PA11)
MISO: U35.12(MTCK) U52.16(MISO_TX)
MOSI: U35.10(MTDI) U52.17(MOSI_RX)
NRST: R26.1 U35.6(GPIO2) U52.3(NRESET)
NSS: U35.8(GPIO3) U52.19(NSS_CTS)
OSD_CS: U42.33(PB12)
RX2(ELRS): R64.2 U42.17(PA3)
RX3: U42.52(PC11) UART2.4
RX4: U42.15(PA1) UART3.4
RX5(ESC): U42.54(PD2) U56.29(PB6)
RX6: U42.38(PC7) UART4.4
SCK: U35.9(MTMS) U52.18(SCK_RTSN)
SDCARD_CS: U42.50(PA15(JTDI))
SERVO: R66.1 U42.58(PB6)
SIG1: R7.2 R10.2 R56.1 U56.6(PA0)
SIG2: R8.2 R11.2 R54.1 U56.10(PA4)
SIG3: R9.2 R12.2 R55.1 U56.11(PA5)
SIG_ALL: R54.2 R55.2 R56.2 U56.7(PA1)
SPI2_MISO: U42.35(PB14)
SPI2_MOSI: U42.36(PB15)
SPI2_SCK: U42.34(PB13)
SWCLK: U56.24(PA14)
SWDIO: U56.23(PA13)
TX1(VTX): U42.42(PA9)
TX2(ELRS): R65.1 U35.27(U0RXD)
TX3: U42.51(PC10) UART2.3
TX4: U42.14(PA0-WKUP(PA0)) UART3.3
TX6: U42.37(PC6) UART4.3
VM: C8.2 C9.2 C10.2 C11.2 C12.2 C18.1 C72.2 C81.1 C82.2 C104.1 C119.2 C121.2 C125.1 C126.2 C127.2 C130.2 C131.2 Q7.5(D) Q7.6(D) Q7.7(D) Q7.8(D) Q7.9(D) Q8.5(D) Q8.6(D) Q8.7(D) Q8.8(D) Q8.9(D) Q9.5(D) Q9.6(D) Q9.7(D) Q9.8(D) Q9.9(D) R17.2 R57.2 R61.2 U29.5(IN-) U58.7(VIN) U59.7(VIN) U67.3(VIN)
VOL_BAT: C19.1 R20.2 R21.2 U42.8(PC0)
VS1: C3.2 Q7.1(S) Q7.2(S) Q7.3(S) Q12.5(D) Q12.6(D) Q12.7(D) Q12.8(D) Q12.9(D) R7.1 U1.18(VS1)
VS2: C4.2 Q8.1(S) Q8.2(S) Q8.3(S) Q11.5(D) Q11.6(D) Q11.7(D) Q11.8(D) Q11.9(D) R8.1 U1.15(VS2)
VS3: C5.1 Q9.1(S) Q9.2(S) Q9.3(S) Q10.5(D) Q10.6(D) Q10.7(D) Q10.8(D) Q10.9(D) R9.1 U1.12(VS3)
$1N2538: C51.2 C52.2 SW1.2 U42.13(VDDA)
$1N3159: R40.1 U42.7(NRST)
$1N3199: C56.1 U42.31(VCAP_1)
$1N3225: C57.1 U42.47(VCAP_2)
$1N3354: R44.1 SW2.1 U42.60(BOOT0)
$1N3523: U42.6(PH1-OSC_OUT(PH1)) X2.3(OSC2)
$1N3528: U42.5(PH0-OSC_IN(PH0)) X2.1(OSC1)
$1N3909: R41.2 U53.A5(CC1)
$1N14327: R42.1 U53.B5(CC2)
$1N15412: LED6.2(A) R43.2
$1N15413: R43.1 U42.39(PC8)
$1N25112: R65.2 U42.16(PA2)
$1N25141: H3.1 R66.2
$1N27338: U53.A4B9(VBUS) U53.A9B4(VBUS) U55.2(A)
$2N4139: R18.1 U29.6(OUT)
$2N14711: LED3.2(A) R37.1
$2N34434: L10.1 U58.6(SW)
$2N34463: R35.2 R36.2 U58.1(FB)
$2N35678: C116.1 R58.1 U58.2(VCC)
$2N36914: R57.1 U58.3(EN)
$2N36943: C101.2 U58.4(BST)
$2N37015: R58.2 U58.8(PG)
$2N37504: C107.2 U59.4(BST)
$2N37507: R62.2 U59.8(PG)
$2N37520: C120.1 R62.1 U59.2(VCC)
$2N37529: R59.2 R60.2 U59.1(FB)
$2N37530: R61.1 U59.3(EN)
$2N37539: L11.1 U59.6(SW)
$2N37656: LED4.2(A) R63.1
$2N43695: C87.1 C101.1 C122.1 D5.2(A) L10.2
$3N23575: Q7.4(G) R1.2
$3N23610: Q12.4(G) R4.2
$3N23669: Q8.4(G) R2.2
$3N23722: Q11.4(G) R5.2
$3N23784: Q9.4(G) R3.2
$3N23789: Q10.4(G) R6.2
$4N1414: AE1.1(ANT) U35.1(LNA_IN)
$4N1415: L2.2 U35.2(VDD3P3) U35.3(VDD3P3)
$4N1425: C28.1 R27.1 U35.7(CHIP_EN)
$4N1429: C96.2 U35.30(XTAL_P) X1.1
$4N1434: C97.1 U35.29(XTAL_N) X1.3
$4N1450: C32.1 U35.18(VDD_SPI)
$4N8239: C62.1 U52.1(VR_PA)
$4N16826: FL1.1(IN) U52.22(RFIO)
$4N18055: R53.2 SW3.1 U35.15(GPIO9)
$4N19180: L8.2 U52.14(DCC_SW)
$4N19324: C65.1 C66.2 L8.1 U52.2(VDD_IN) U52.12(DCC_FB)
$4N19361: C98.2 U52.4(XTA)
$4N19425: C98.1 U57.3(OUT)
$4N27786: R64.1 U35.28(U0TXD)
Net-(C3-1): C3.1 U1.20(VB1) U64.1
Net-(C4-1): C4.1 U1.17(VB2) U65.1
Net-(C5-2): C5.2 U1.14(VB3) U66.1
Net-(R13-2): R13.2 U56.4(NRST)
Net-(R14-1): R14.1 U56.31(BOOT0)
Net-(R16-2): R16.2 U56.27(PB4)

Not connected (* = marked no-connect by the designer): AE1 2*; LED8 1(DO)*; U1 5(NC)* 7(NC)* 8(NC)* 21(NC)*; U35 4(XTAL_32K_P)* 5(XTAL_32K_N)* 19(SPIHD)* 20(SPIWP)* 21(SPICS0)* 22(SPICLK)* 23(SPID)* 24(SPIQ)*; U38 4(NC)*; U40 4(NC)*; U42 2(PC13) 3(PC14-OSC32_IN(PC14)) 4(PC15-OSC32_OUT(PC15)) 10(PC2) 11(PC3) 24(PC4) 27(PB1) 28(PB2-BOOT1(PB2)) 29(PB10) 30(PB11) 40(PC9) 41(PA8) 43(PA10) 46(PA13(JTMS-SWDIO)) 49(PA14(JTCK-SWCLK)) 53(PC12) 55(PB3(JTDOTRACESWO)) 56(PB4(NJTRST)) 57(PB5) 59(PB7) 61(PB8) 62(PB9); U43 2(ASDX)* 3(ASCX)* 4(INT1) 9(INT2)* 10(OCSB)* 11(OSDO)*; U52 6(XTB)* 9(DIO2)* 10(DIO3)*; U53 A8(SBU1) B8(SBU2); U56 2(PF0/OSC_IN)* 3(PF1/OSC_OUT)* 8(PA2)* 9(PA3)* 12(PA6)* 16(PB2)* 21(PA11)* 22(PA12)* 25(PA15)* 26(PB3)* 28(PB5)* 30(PB7)* 32(PB8)*; U57 1(NC/VC)*

## Notes on the sheets
sheet 1
- GYRO-BMI270
- USB
- FLASH
- MCU
- 2026/25/02  21:59:43
- OSD
- F405-MCU
- POWER-f405
sheet 2
- 6V-SERVO(5.76V)
- 5v-f405(4.88V)
- 3.3v-mcu
- 3.3v-ESP32
- VM
- 2026/27/06 13:02:46
- ADC CURRENT
- VOL
sheet 3
- GATE DRIVE
- x
- MOSFET
- x
- x
- 2026/27/06 13:02:36
- MCU ESC
sheet 4
- ESP32-C3
- SX1281
- ELRS
- 2026/27/06 13:01:59
- LED
